# EAGLE design TransmitAnalog (EAGLE 8.4.0)
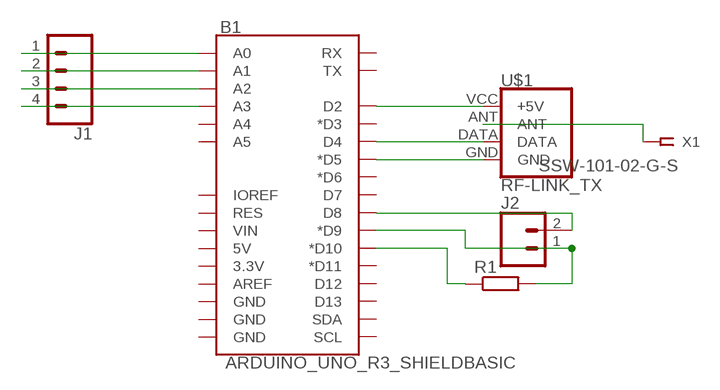
[diagram p0: schematic, sheet 1]

## Parts
B1  ARDUINO_UNO_R3_SHIELDBASIC  [UNO_R3_SHIELD]
J1  CONN_04  [1X04]
J2  CONN_02  [1X02]
R1  R-EU_0204/7  [0204/7]
U$1  RF-LINK_TX  [RF-LINK_TX]
X1  SSW-101-02-G-S  [SSW-101-02-G-S]

## Nets
N$1: B1.A0 J1.1
N$2: B1.A1 J1.2
N$3: B1.A2 J1.3
N$4: B1.A3 J1.4
N$5: B1.D2 U$1.VCC(+5V)
N$6: B1.D4 U$1.DATA
N$7: B1.D5(*D5) U$1.GND
N$8: U$1.ANT X1.1
N$9: B1.D8 J2.2
N$10: B1.D9(*D9) J2.1 R1.2
N$11: B1.D10(*D10) R1.1
Unconnected: B1.3.3V B1.5V B1.A4 B1.A5 B1.AREF B1.D3(*D3) B1.D6(*D6) B1.D7 B1.D11(*D11) B1.D12 B1.D13 B1.GND@0(GND) B1.GND@1(GND) B1.GND@2(GND) B1.IOREF B1.RES B1.RX B1.SCL B1.SDA B1.TX B1.VIN

## Library data of the parts
B1 = SparkFun-Boards:ARDUINO_UNO_R3_SHIELD: Arduino R3 Shield Footprint Shield form compatible with the Arduino Uno R3. SparkFun Products: MG2639 Cellular Shield <https://www.sparkfun.com/products/13120> MIDI Shield <https://www.sparkfun.com/products/12898> R3 Stackable Headers Kit <https://www.sparkfun.com/products/11417>
J1 = SparkFun-Connectors:CONN_04: Multi connection point. Often used as Generic Header-pin footprint for 0.1 inch spaced/style header connections On any of the 0.1 inch spaced packages, you can populate with these: Break Away Headers - Straight <https://www.sparkfun.com/products/116> (PRT-00116) Break Away Male Headers - Right Angle <https://www.sparkfun.com/products/553> (PRT-00553) Female Headers <https://www.sparkfun.com/products/115> (PRT-00115) Break Away Headers - Machine Pin <https://www.sparkfun.com/products/117> (PRT-00117) Break Away Female Headers - Swiss Machine Pin <https://www.sparkfun.com/products/743> (PRT-00743) For SCREWTERMINALS and SPRING TERMINALS visit here: Screw Terimnals on SparkFun.com <https://www.sparkfun.com/search/results?term=Screw+Terminals> (5mm/3.5mm/2.54mm spacing) This device is also useful as a general connection point to wire up your design to another part of your project. Our various solder wires solder well into these plated through hole pads. Hook-Up Wire - Assortment (Stranded, 22 AWG) <https://www.sparkfun.com/products/11375> (PRT-11375) Hook-Up Wire - Assortment (Solid Core, 22 AWG) <https://www.sparkfun.com/products/11367> (PRT-11367) View the entire wire category on our website here <https://www.sparkfun.com/categories/141> Special notes: Molex polarized connector foot print use with SKU : PRT-08231 with associated crimp pins and housings. 1MM SMD Version SKU: PRT-10208; PROD_ID: CONN-09696
J2 = SparkFun-Connectors:CONN_02: Multi connection point. Often used as Generic Header-pin footprint for 0.1 inch spaced/style header connections On any of the 0.1 inch spaced packages, you can populate with these: Break Away Headers - Straight <https://www.sparkfun.com/products/116> (PRT-00116) Break Away Male Headers - Right Angle <https://www.sparkfun.com/products/553> (PRT-00553) Female Headers <https://www.sparkfun.com/products/115> (PRT-00115) Break Away Headers - Machine Pin <https://www.sparkfun.com/products/117> (PRT-00117) Break Away Female Headers - Swiss Machine Pin <https://www.sparkfun.com/products/743> (PRT-00743) For SCREWTERMINALS and SPRING TERMINALS visit here: Screw Terimnals on SparkFun.com <https://www.sparkfun.com/search/results?term=Screw+Terminals> (5mm/3.5mm/2.54mm spacing) This device is also useful as a general connection point to wire up your design to another part of your project. Our various solder wires solder well into these plated through hole pads. Hook-Up Wire - Assortment (Stranded, 22 AWG) <https://www.sparkfun.com/products/11375> (PRT-11375) Hook-Up Wire - Assortment (Solid Core, 22 AWG) <https://www.sparkfun.com/products/11367> (PRT-11367) View the entire wire category on our website here <https://www.sparkfun.com/categories/141> Special notes: Molex polarized connector foot print use with: PRT-08233 with associated crimp pins and housings. 2.54_SCREWTERM for use with PRT-10571. 3.5mm Screw Terminal footprints for PRT-08084 5mm Screw Terminal footprints for use with PRT-08432
R1 = rcl:R-EU_: RESISTOR, European symbol; SPICEPREFIX: R
U$1 = SparkFun-RF:RF-LINK_TX: RF Link Transmitter (434 MHz, 315 MHz) These wireless transmitters work with equivalent receivers. They can easily fit into a breadboard and work well with microcontrollers to create a very simple wireless data link. Since these are only transmitters, they will only work communicating data one-way, you would need two pairs (of different frequencies) to act as a transmitter/receiver pair. SparkFun Products RF Link Transmitter - 434MHz <https://www.sparkfun.com/products/10534> (WRL-10534); SF_ID: WRL-10534
X1 = con-samtec:SSW-101-02-G-S: THROUGH-HOLE .025" SQ POST SOCKET Source: Samtec SSW.pdf; MF: Samtec Inc.; MPN: SSW-101-02-G-S; OC_FARNELL: unknown; OC_NEWARK: 11P9336

## Board
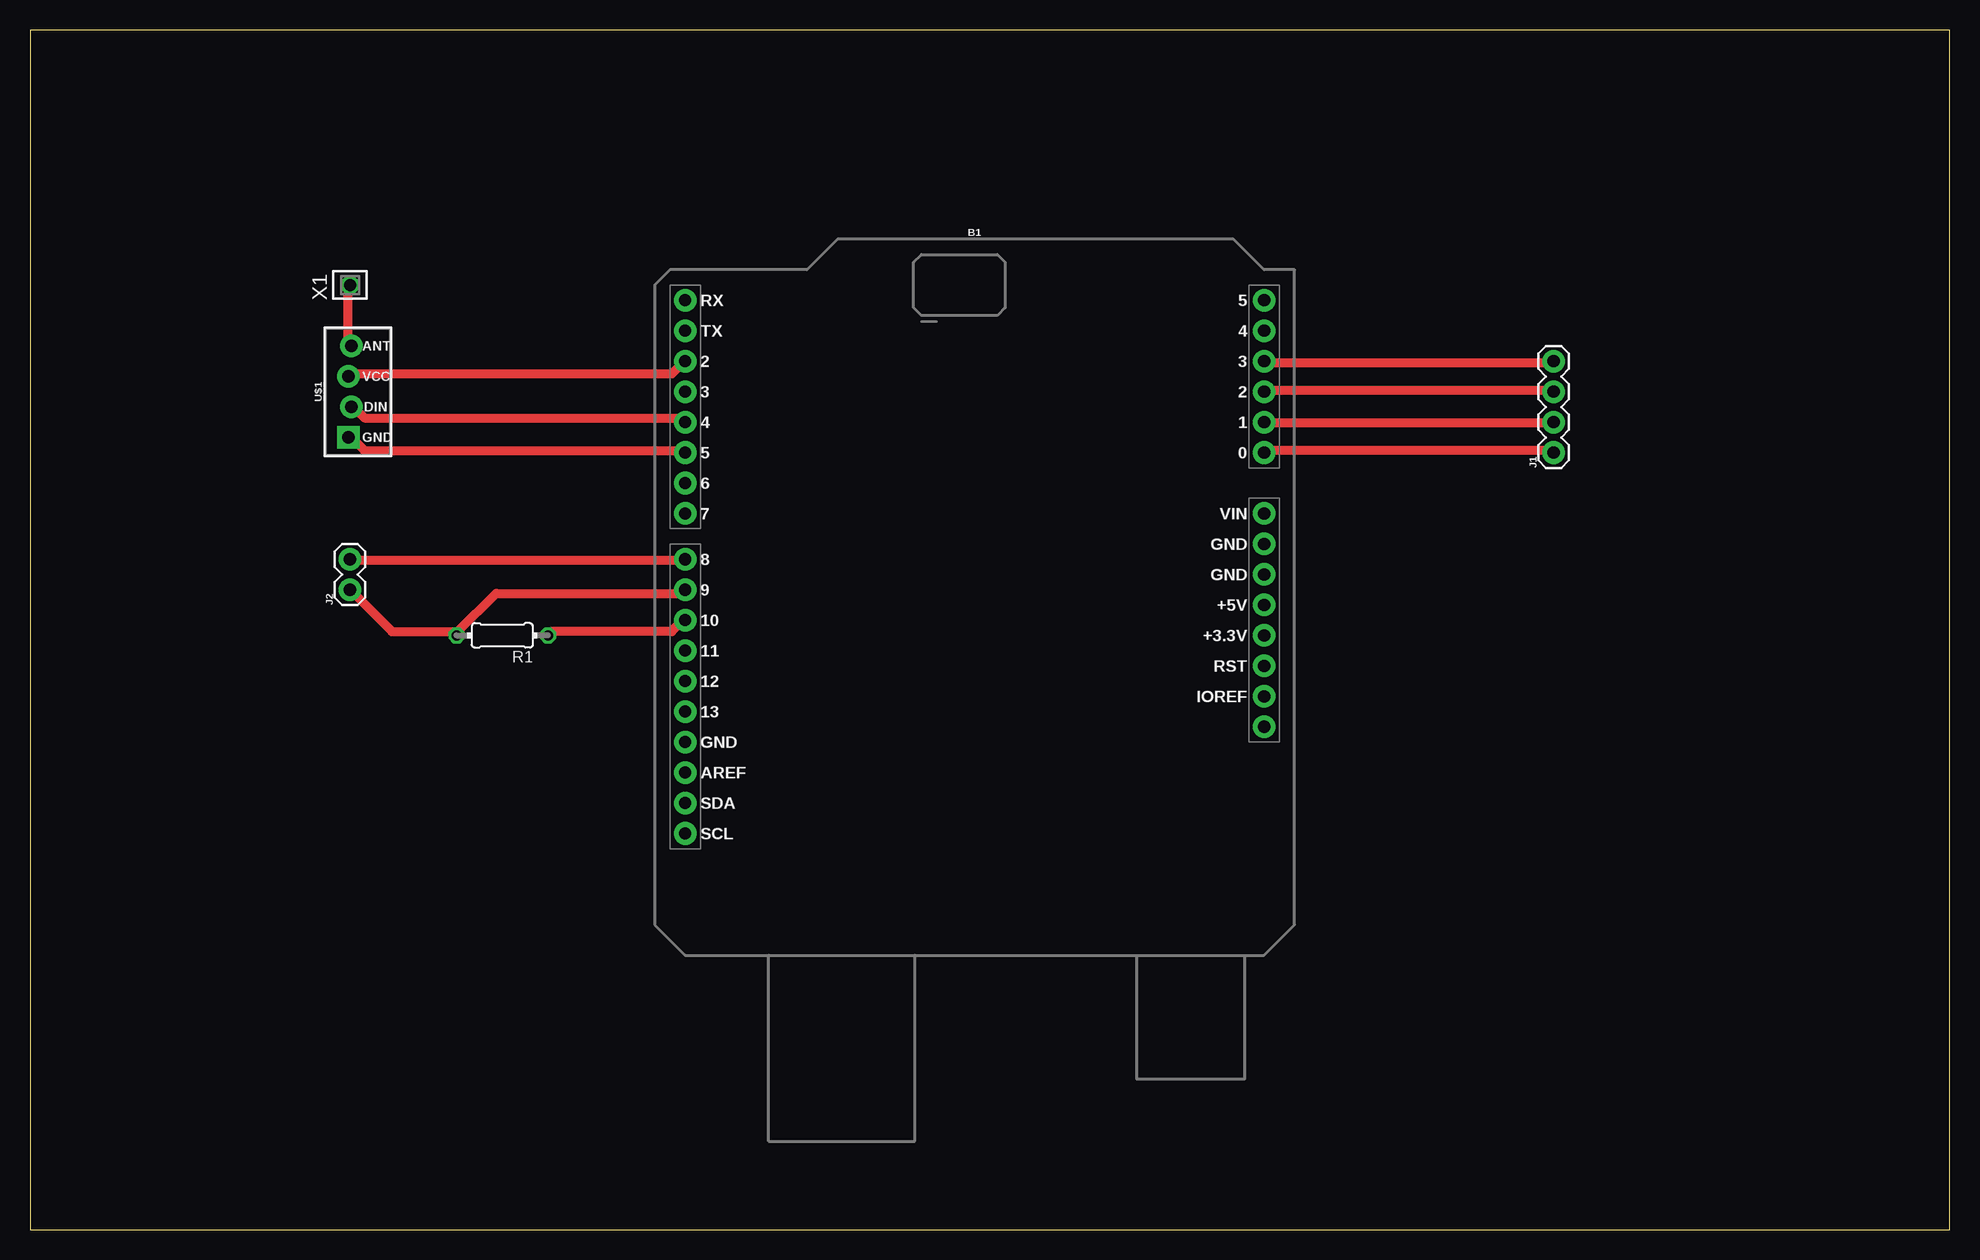
[diagram p1: board, top side]

Size 160 x 100 mm. Coordinates in mm from the lower left corner, seen from the top.
Outline: 0,0 160,0 160,100 0,100 0,0
Copper layers (1*16): Top 0.035mm / dielectric 1.5mm / Bottom 0.035mm
Design rules "default *": minimum track width 30mil, minimum drill 10mm, track to track 6mil, track to pad 6mil, pad to pad 6mil, via to via 6mil, smd to smd 6mil, copper to edge 40mil, drill to drill 6mil, minimum pad ring 10mil, minimum via ring 8mil, stop-mask expansion 4mil, vias tented up to drill 0mil, thermal gap 10mil

### Footprints (pad centres in the part's own frame; a part is rotated, then mirrored left to right if it is on the bottom)
UNO_R3_SHIELD = drill 1.016 pad 1.88: 3.3V 24.13,-2.54; 5V 24.13,0; A0 24.13,12.7; A1 24.13,15.24; A2 24.13,17.78; A3 24.13,20.32; A4 24.13,22.86; A5 24.13,25.4; AREF -24.13,-13.97; D2 -24.13,20.32; D3 -24.13,17.78; D4 -24.13,15.24; D5 -24.13,12.7; D6 -24.13,10.16; D7 -24.13,7.62; D8 -24.13,3.81; D9 -24.13,1.27; D10 -24.13,-1.27; D11 -24.13,-3.81; D12 -24.13,-6.35; D13 -24.13,-8.89; GND@0 24.13,2.54; GND@1 24.13,5.08; GND@2 -24.13,-11.43; IOREF 24.13,-7.62; NC 24.13,-10.16; RES 24.13,-5.08; RX -24.13,25.4; SCL -24.13,-19.05; SDA -24.13,-16.51; TX -24.13,22.86; VIN 24.13,7.62
1X04 = drill 1.016 pad 1.88: 1 0,0; 2 2.54,0; 3 5.08,0; 4 7.62,0
1X02 = drill 1.016 pad 1.88: 1 0,0; 2 2.54,0
0204/7 = drill 0.813 octagon: 1 -3.81,0; 2 3.81,0
RF-LINK_TX = drill 1.016 pad 1.88: ANT 3.81,-0.127; DATA -1.27,-0.127; VCC 1.27,0.127 | drill 1.016 pad 1.88 square: GND -3.81,0.127
SSW-101-02-G-S = drill 1 pad 1.5 octagon: 1 0,0

### Placement (x,y rotation side)
B1  78.74,52.07 0 top
J1  127,64.77 90 top
J2  26.67,53.34 90 top
R1  39.37,49.53 180 top
U$1  26.67,69.85 90 top
X1  26.67,78.74 0 top

### Tracks (layer width: path | path; a pad name or v marks a point on that pad's centre or on a via)
N$1
  Top 0.762: B1.A0 102.87,64.92 126.64,64.92 J1.1
N$2
  Top 0.762: B1.A1 102.87,67.21 126.64,67.21 J1.2
N$3
  Top 0.762: B1.A2 102.87,69.95 126.64,69.95 J1.3
N$4
  Top 0.762: B1.A3 102.87,72.24 126.64,72.24 J1.4
N$5
  Top 0.762: U$1.VCC 26.98,71.32 53.49,71.32 54.41,72.24 B1.D2
N$6
  Top 0.762: B1.D4 54.41,67.67 27.89,67.67 26.98,68.58 U$1.DATA
N$7
  Top 0.762: B1.D5 54.41,64.92 27.89,64.92 26.98,65.84 U$1.GND
N$8
  Top 0.762: X1.1 26.52,78.64 26.52,74.07 U$1.ANT
N$9
  Top 0.762: J2.2 26.98,55.78 54.41,55.78 B1.D8
N$10
  Top 0.762: J2.1 30.18,49.84 35.2,49.84 R1.2 35.66,49.84 38.86,53.03 54.41,53.03 B1.D9
N$11
  Top 0.762: R1.1 43.43,49.84 53.49,49.84 54.41,50.75 B1.D10